# Altium schematic sheet overview.SchDoc: Overview
size A3; SheetNumber: 1; SheetTotal: 16
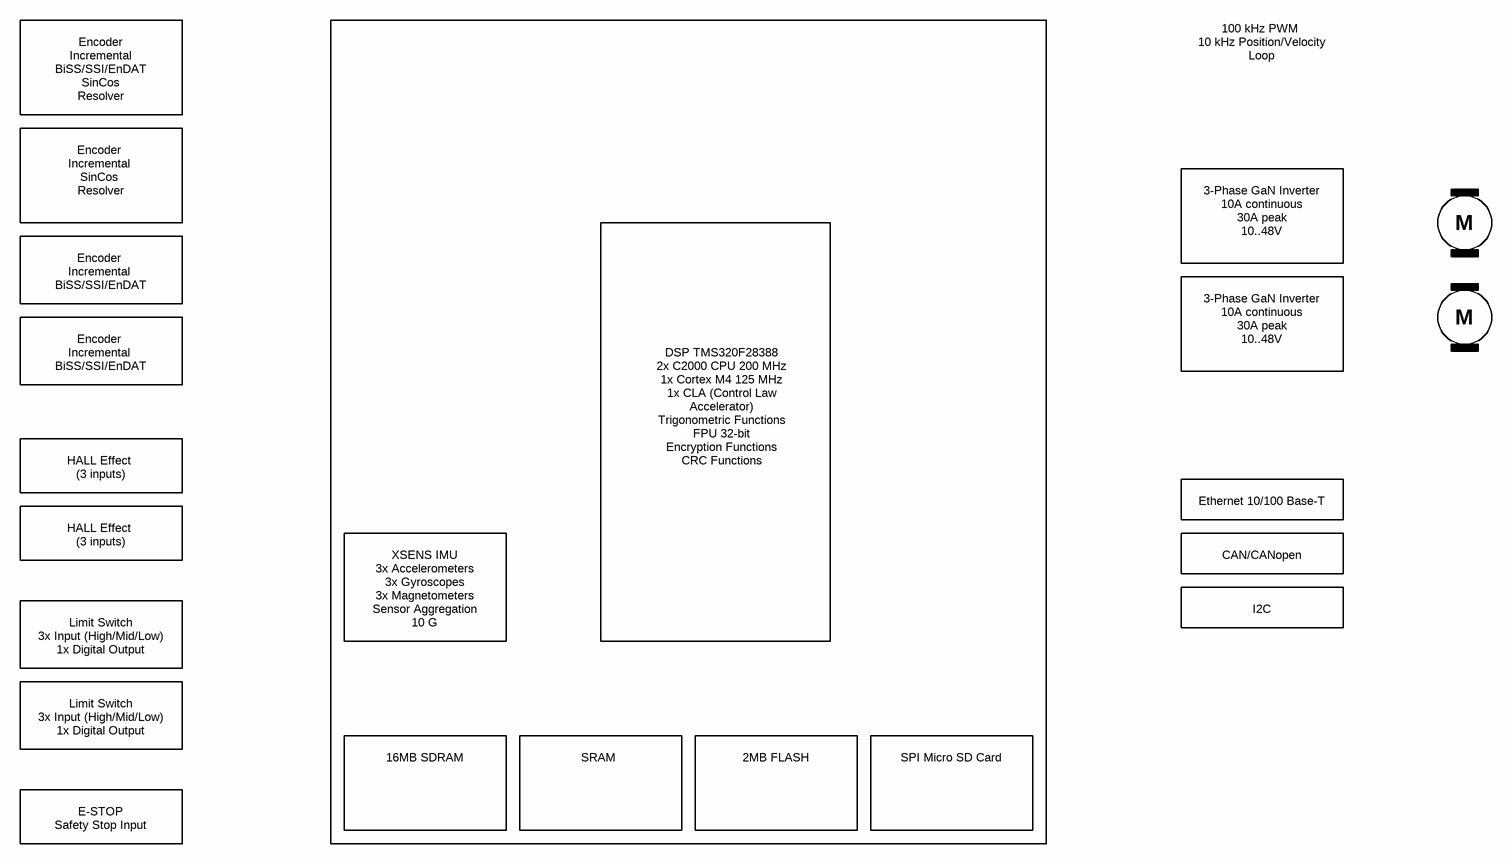
[diagram p0: overview.SchDoc]

## Notes on the sheet
- Encoder
  Incremental
  BiSS/SSI/EnDAT
  SinCos
  Resolver
- 100 kHz PWM
  10 kHz Position/Velocity Loop
- Encoder
  Incremental
  SinCos
  Resolver
- 3-Phase GaN Inverter
  10A continuous
  30A peak
  10..48V
- M
- Encoder
  Incremental
  BiSS/SSI/EnDAT
- HALL Effect
  (3 inputs)
- DSP TMS320F28388
  2x C2000 CPU 200 MHz
  1x Cortex M4 125 MHz
  1x CLA (Control Law Accelerator)
  Trigonometric Functions
  FPU 32-bit
  Encryption Functions
  CRC Functions
- Ethernet 10/100 Base-T
- CAN/CANopen
- I2C
- Limit Switch
  3x Input (High/Mid/Low)
  1x Digital Output
- XSENS IMU
  3x Accelerometers
  3x Gyroscopes
  3x Magnetometers
  Sensor Aggregation
  10 G
- 16MB SDRAM
- SRAM
- 2MB FLASH
- SPI Micro SD Card
- E-STOP
  Safety Stop Input
- HES-SO / HEIG-VD / TIN / IAI
  Route de Cheseaux, 1
  CH-1401 Yverdon-les-Bains
  T +41 24 557 73 77    F +41 24 557 63 20
  http://iai.heig-vd.ch
  iai@heig-vd.ch
- Title
- Size
- Date
- A4
- Project
- Sheet
- of
- No.
- Author
- SVN/Git
- Version
- File